# Altium schematic sheet Thermal camera.SchDoc
size A4; SheetNumber: 4; SheetTotal: 5
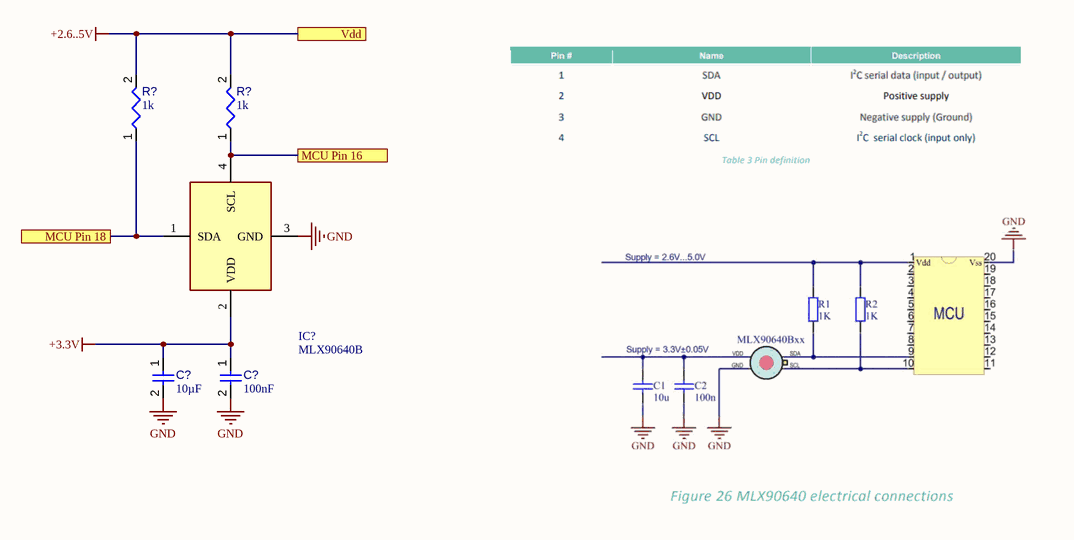
[diagram p0: Thermal camera.SchDoc]

## Parts
(Parts that share a designator on the sheet are numbered #1, #2 ... from top to bottom, then left to right.)
C?#1  value 10µF  [CAPC0603(1608)100_L]  (hidden comment: Capacitor 10µF +/-20% 10V 0603)
C?#2  value 100nF  [CAPC0402(1005)60_L]  (hidden comment: Capacitor 100nF +/-20% 10V 0402)
IC?  MLX90640B  [MLX90640ESFBAA000TU]
R?#1  value 1k  [RESC0402(1005)_L]  (hidden comment: Resistor 1K +/-5 % 0402 63 mW)
R?#2  value 1k  [RESC0402(1005)_L]  (hidden comment: Resistor 1K +/-5 % 0402 63 mW)

## Ports
MCU Pin 16, MCU Pin 18, Vdd

## Nets
+2.6..5V: R?#1.2 R?#2.2 ; port Vdd
+3.3V: C?#1.1 C?#2.1 IC?.2(VDD)
GND: C?#1.2 C?#2.2 IC?.3(GND)
MCU Pin 16: IC?.4(SCL) R?#2.1 ; port MCU Pin 16
MCU Pin 18: IC?.1(SDA) R?#1.1 ; port MCU Pin 18

## Library data of the parts
C?#1 = CMP-001-00075-4: Chip Capacitor, 10µF +/-20%, 10V, 0603, Thickness 1 mm; Tolerance: 10%; Voltage Rating: 10V; Max Operating Temperature: 85°C; Pins: 2; Case/Package: 0603; Mounting Technology: SMT; Min Operating Temperature: -55°C
C?#2 = CMP-001-00061-3: Chip Capacitor, 100nF +/-20%, 10V, 0402, Thickness 0.6 mm; Tolerance: 20%; Mounting Technology: SMT; Voltage Rating: 10V; Max Operating Temperature: 85°C; Pins: 2; Case/Package: 0402; Min Operating Temperature: -55°C
IC? = MLX90640ESF-BAA-000-SP: Integrated Circuit; Manufacturer_Name: Melexis; Datasheet Link: https://componentsearchengine.com/Datasheets/1/MLX90640ESF-BAA-000-SP.pdf; Height: 6mm; Manufacturer_Part_Number: MLX90640ESF-BAA-000-SP; Mouser Part Number: 482-MLX90640ESFBAASP; Mouser Price/Stock: https://www.mouser.co.uk/ProductDetail/Melexis/MLX90640ESF-BAA-000-SP?qs=y6ZabgHbY%252Bz1Luyoz5kAtA%3D%3D; Arrow Part Number: MLX90640ESF-BAA-000-SP; Arrow Price/Stock: https://www.arrow.com/en/products/mlx90640esf-baa-000-sp/melexis?region=nac
R?#1 R?#2 = CMP-009-00157-3: Chip Resistor, 1 kOhms, +/-5 %, 63 mW, -55 to 155 degC, 0402; Tolerance: 5%; Power: 63mW; Case/Package: 0402; Pins: 2; Min Operating Temperature: -55°C; Max Operating Temperature: 155°C